# EAGLE design solarSwitcherV2.0 (EAGLE 7.2.0)
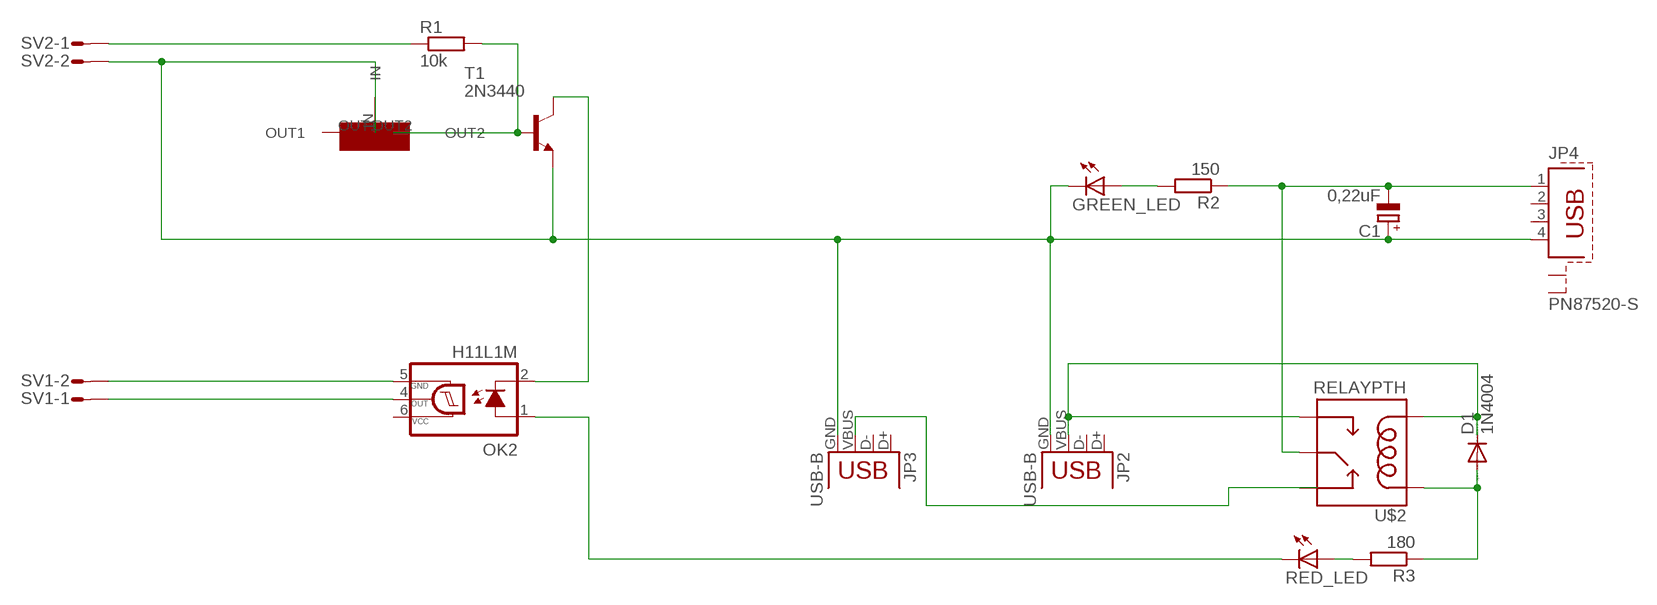
[diagram p0: schematic, sheet 1]

## Parts
C1  0,22uF  CPOL-EU150CLZ-1014  [150CLZ-1014]
D1  1N4004  [DO41-10]
GREEN_LED  LED5MM  [LED5MM]
JP2  USB-B  USBPTH  [USB-B-PTH]
JP3  USB-B  USBPTH  [USB-B-PTH]
JP4  PN87520-S  [PN87520-S]
OK2  H11L1M  [DIL06]
R1  10k  R-EU_0207/10  [0207/10]
R2  150  R-EU_0207/10  [0207/10]
R3  180  R-EU_0207/10  [0207/10]
RED_LED  LED5MM  [LED5MM]
SV1  L02P  [L02P]
SV2  L02P  [L02P]
T1  2N3440  [TO5]
U$2  RELAYPTH  [SRD-05VDC-SL-C]
U$5  20k  POT_TRIMMER  [POT_TRIMMER]

## Nets
N$1: R1.2 T1.2(B) U$5.OUT2
N$2: C1.- JP4.1 R2.1 U$2.SWCOMMON
N$3: OK2.1(A) RED_LED.K(C)
N$4: OK2.4(OUT) SV1.1
N$5: R1.1 SV2.1
N$6: JP3.VBUS U$2.SWCLOSED(SWCLOSE)
N$7: OK2.5(GND) SV1.2
N$8: C1.+ GREEN_LED.K(C) JP2.GND JP3.GND JP4.4 SV2.2 T1.1(E) U$5.IN
N$9: OK2.2(C) T1.3(C)
N$10: D1.A R3.1 U$2.COIL1
N$12: D1.C JP2.VBUS U$2.COIL0 U$2.SWOPEN
N$13: GREEN_LED.A R2.2
N$14: R3.2 RED_LED.A
Unconnected: JP2.D+ JP2.D- JP3.D+ JP3.D- JP4.2 JP4.3 JP4.S1 JP4.S2 U$5.OUT1

## Power pins joined to a net without a drawn wire
VCC: OK2.6(VCC)

## Library data of the parts
C1 = rcl:CPOL-EU: POLARIZED CAPACITOR, European symbol
D1 = diode:1N4004: DIODE general purpose rectifier, 1 A
GREEN_LED RED_LED = led:LED: LED OSRAM: - CHIPLED LG R971, LG N971, LY N971, LG Q971, LY Q971, LO R971, LY R971 LH N974, LH R974 LS Q976, LO Q976, LY Q976 LO Q996 - Hyper CHIPLED LW Q18S LB Q993, LB Q99A, LB R99A - SideLED LS A670, LO A670, LY A670, LG A670, LP A670 LB A673, LV A673, LT A673, LW A673 LH A674 LY A675 LS A676, LA A676, LO A676, LY A676, LW A676 LS A679, LY A679, LG A679 - Hyper Micro SIDELED® LS Y876, LA Y876, LO Y876, LY Y876 LT Y87S - SmartLED LW L88C, LW L88S LB L89C, LB L89S, LG L890 LS L89K, LO L89K, LY L89K LS L896, LA L896, LO L896, LY L896 - TOPLED LS T670, LO T670, LY T670, LG T670, LP T670 LSG T670, LSP T670, LSY T670, LOP T670, LYG T670 LG T671, LOG T671, LSG T671 LB T673, LV T673, LT T673, LW T673 LH T674 LS T676, LA T676, LO T676, LY T676, LB T676, LH T676, LSB T676, LW T676 LB T67C, LV T67C, LT T67C, LS T67K, LO T67K, LY T67K, LW E67C LS E67B, LA E67B, LO E67B, LY E67B, LB E67C, LV E67C, LT E67C LW T67C LS T679, LY T679, LG T679 LS T770, LO T770, LY T770, LG T770, LP T770 LB T773, LV T773, LT T773, LW T773 LH T774 LS E675, LA E675, LY E675, LS T675 LS T776, LA T776, LO T776, LY T776, LB T776 LHGB T686 LT T68C, LB T68C - Hyper Mini TOPLED® LB M676 - Mini TOPLED Santana® LG M470 LS M47K, LO M47K, LY M47K Source: http://www.osram.convergy.de LUXEON: - LUMILED® LXK2-PW12-R00, LXK2-PW12-S00, LXK2-PW14-U00, LXK2-PW14-V00 LXK2-PM12-R00, LXK2-PM12-S00, LXK2-PM14-U00 LXK2-PE12-Q00, LXK2-PE12-R00, LXK2-PE12-S00, LXK2-PE14-T00, LXK2-PE14-U00 LXK2-PB12-K00, LXK2-PB12-L00, LXK2-PB12-M00, LXK2-PB14-N00, LXK2-PB14-P00, LXK2-PB14-Q00 LXK2-PR12-L00, LXK2-PR12-M00, LXK2-PR14-Q00, LXK2-PR14-R00 LXK2-PD12-Q00, LXK2-PD12-R00, LXK2-PD12-S00 LXK2-PH12-R00, LXK2-PH12-S00 LXK2-PL12-P00, LXK2-PL12-Q00, LXK2-PL12-R00 Source: www.luxeon.com KINGBRIGHT: KA-3528ASYC Source: www.kingbright.com
JP2 JP3 = SparkFun-Connectors:USB: USB Connectors USB-B-PTH is fully proven SKU : PRT-00139/CONN-08278 USB-miniB is fully proven SKU : PRT-00587 USB-A-PCB is untested. USB-A-H is throughly reviewed, but untested. Spark Fun Electronics SKU : PRT-00437 USB-B-SMT is throughly reviewed, but untested. Needs silkscreen touching up. USB-A-S has not been used/tested USB-MB-H has not been used/tested USB-MICROB has been used. CONN-09505; PROD_ID: CONN-08278
JP4 = con-berg:PN87520-S; OC_FARNELL: unknown; OC_NEWARK: unknown
OK2 = optocoupler:H11L*M: 6-Pin DIP Optocoupler Source: http://www.fairchildsemi.com/ds/H1/H11L2-M.pdf; MF: FAIRCHILD SEMICONDUCTOR; MPN: H11L1-M; OC_FARNELL: 1021127; OC_NEWARK: 72K8643
R1-R3 = resistor:R-EU_: RESISTOR, European symbol
SV1 SV2 = con-amp-mt:L02P: AMP MT CONNECTOR; OC_FARNELL: unknown; OC_NEWARK: unknown
T1 = transistor:2N3440: NPN TRANSISTOR
U$2 = SRD-05VDC-SL-C:RELAY: SPDT relay (COM-00101)
U$5 = MBLIB:POT_TRIMMER

## Board
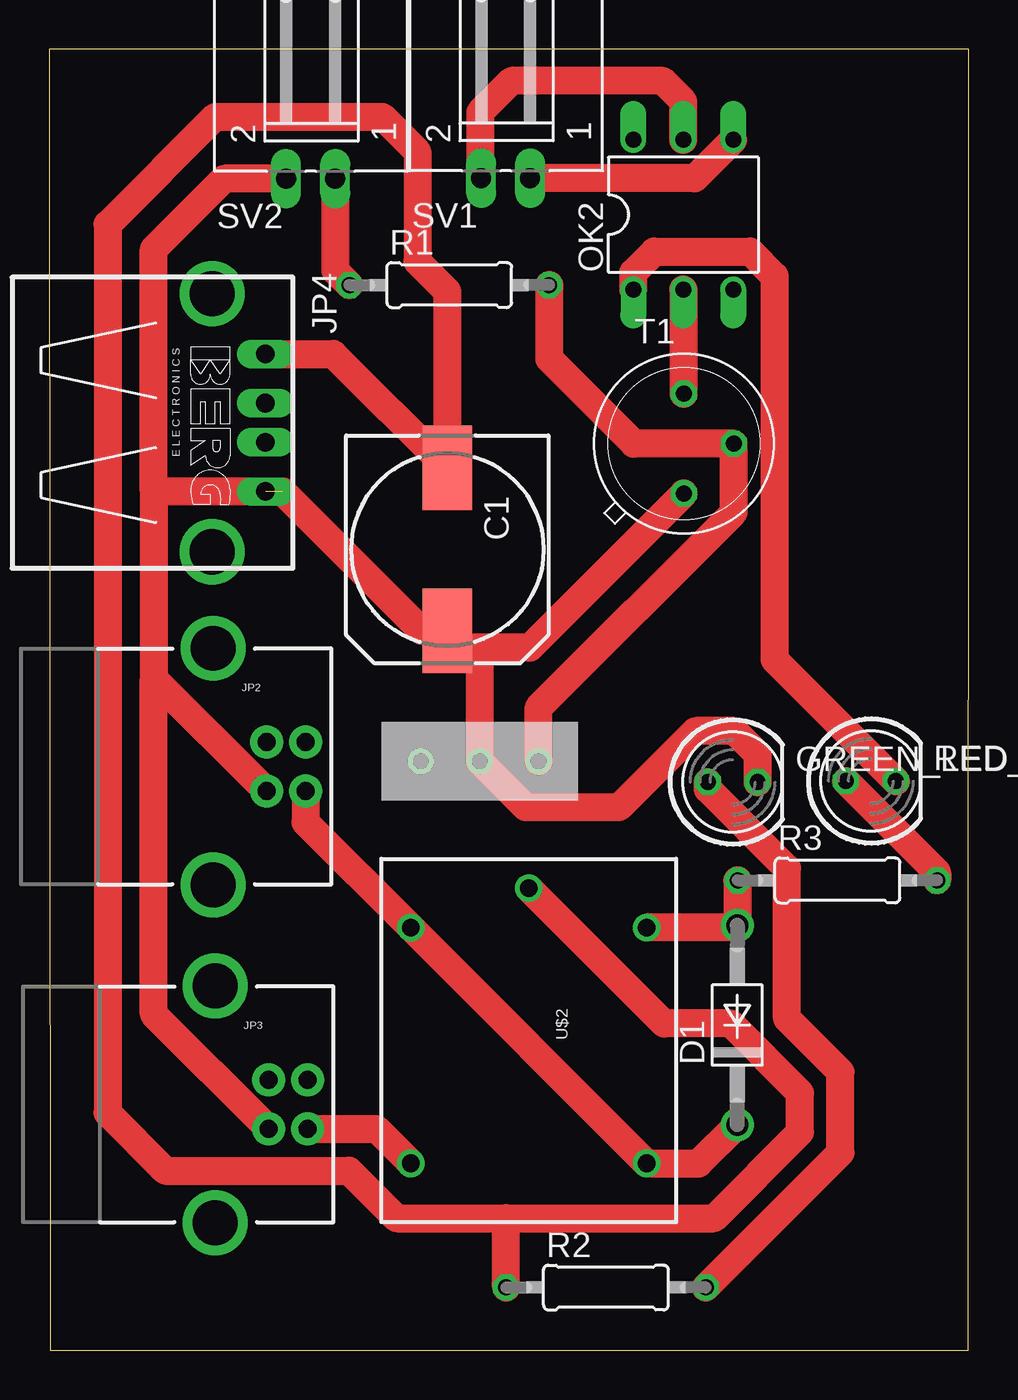
[diagram p1: board, top side]
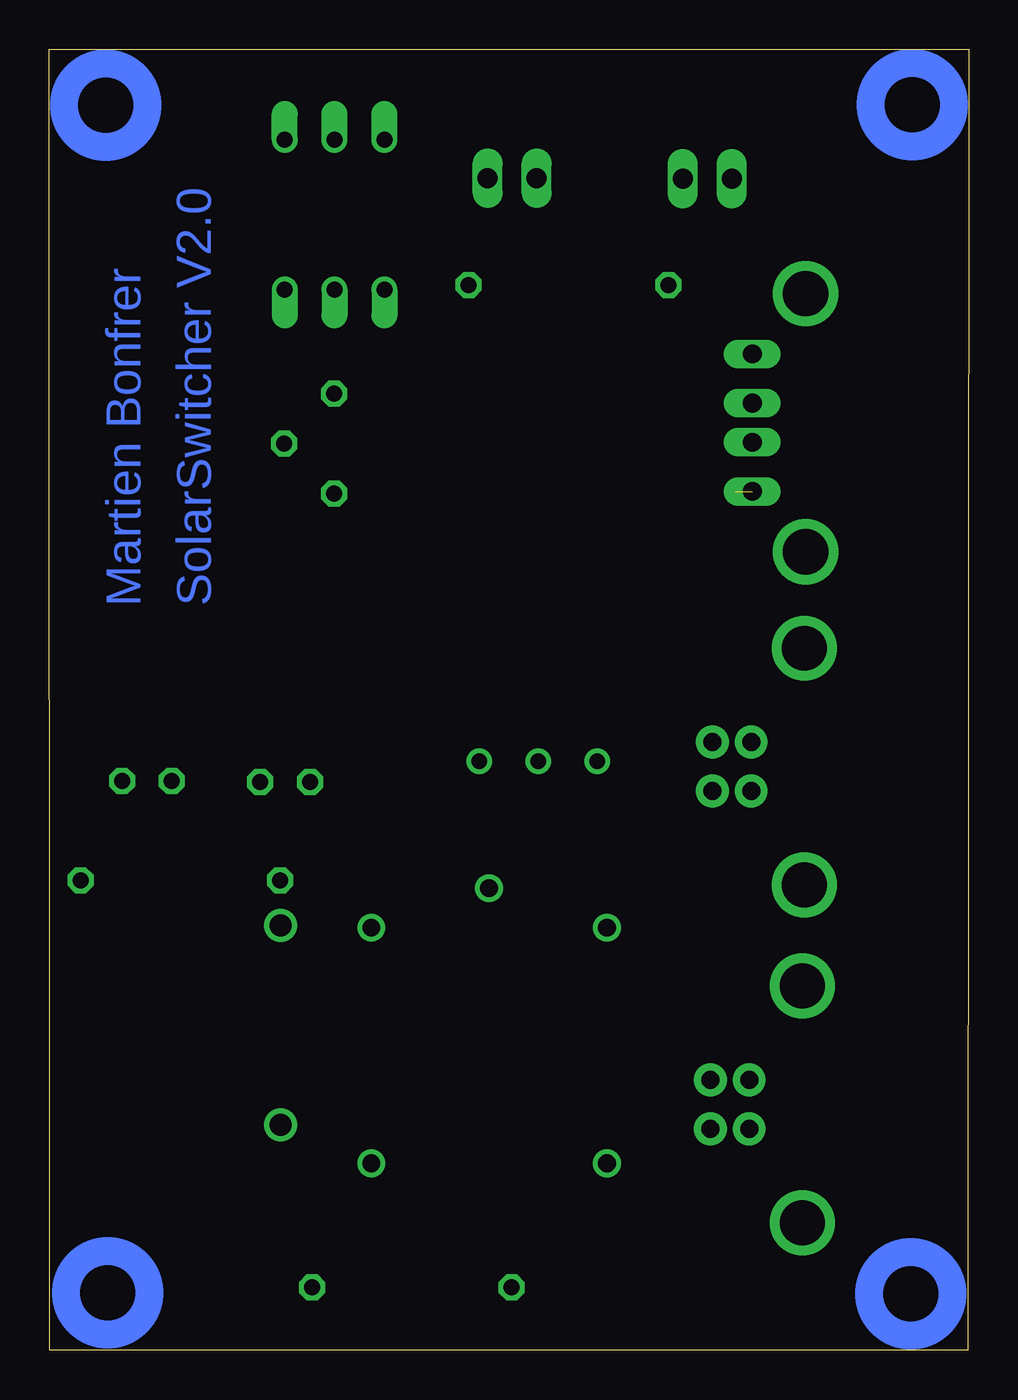
[diagram p2: board, bottom side, seen from below]

Size 46.81 x 66.23 mm. Coordinates in mm from the lower left corner, seen from the top.
Outline: 0.05,0 46.79,0 46.81,66.23 0,66.23 0.05,0
Copper layers (1*16): Top 0.035mm / dielectric 1.5mm / Bottom 0.035mm
Design rules "default": minimum track width 10mil, minimum drill 24mil, track to track 8mil, track to pad 8mil, pad to pad 8mil, via to via 8mil, smd to smd 8mil, copper to edge 40mil, drill to drill 8mil, minimum pad ring 10mil, minimum via ring 8mil, stop-mask expansion 4mil, vias tented up to drill 0mil, thermal gap 10mil

### Footprints (pad centres in the part's own frame; a part is rotated, then mirrored left to right if it is on the bottom)
150CLZ-1014 = smd 4.3 x 2.5: + 4.15,0; - -4.15,0
DO41-10 = drill 1.118: A 5.08,0; C -5.08,0
LED5MM = drill 0.813 octagon: A -1.27,0; K 1.27,0
USB-B-PTH = drill 0.914 pad 1.676: D+ 0,1.25; D- 1.981,1.25; GND 0,-1.25; VBUS 1.981,-1.25 | drill 2.286: S1 -2.718,-6.02; S2 -2.718,6.02
PN87520-S = drill 0.95 long: 1 -3.5,2.71; 2 -1,2.71; 3 1,2.71; 4 3.5,2.71 | drill 2.3 pad 2.9: S1 -6.57,0; S2 6.57,0
DIL06 = drill 0.813 offset: 1 -2.54,-3.81; 2 0,-3.81; 3 2.54,-3.81; 4 2.54,3.81; 5 0,3.81; 6 -2.54,3.81
0207/10 = drill 0.813 octagon: 1 -5.08,0; 2 5.08,0
L02P = drill 1.016 long: 1 1.25,-6.25; 2 -1.25,-6.25
TO5 = drill 0.813 octagon: 1 0,-2.54; 2 2.54,0; 3 0,2.54
SRD-05VDC-SL-C = drill 0.9: COIL0 -5.39,-6.12; COIL1 -5.39,5.88; SWCLOSED 6.61,-6.12; SWCOMMON -7.39,-0.12; SWOPEN 6.61,5.88
POT_TRIMMER = drill 0.8: IN 5,2; OUT1 2,2; OUT2 8,2

### Placement (x,y rotation side)
C1  20.27,40.77 270 top
D1  35.03,16.56 90 top
GREEN_LED  34.8,28.93 0 top
JP2  11.07,29.72 0 top
JP3  11.18,12.52 0 top
JP4  8.31,47.22 270 top
OK2  32.28,57.81 0 top
R1  20.37,54.23 0 top
R2  28.35,3.2 0 top
R3  40.13,23.93 0 top
RED_LED  41.83,28.98 0 top
SV1  23.24,65.91 0 top
SV2  13.31,65.89 0 top
T1  32.31,46.15 0 top
U$2  24.54,16.13 270 top
U$5  16.92,27.99 0 top

### Tracks (layer width: path | path; a pad name or v marks a point on that pad's centre or on a via)
N$1
  Top 1.422: R1.2 25.45,50.47 29.77,46.15 T1.2 34.85,42.65 24.92,32.71 U$5.OUT2
N$2
  Top 1.422: JP4.1 14.47,50.72 C1.- 20.27,53.9 18.75,55.42 18.75,61.01 16.97,62.79 8.46,62.79 2.97,57.3 2.97,12.09 5.92,9.14 15.27,9.14 17.68,6.73 23.27,6.73 | 23.27,6.73 33.86,6.73 38.23,11.1 38.23,13.11 34.7,16.64 31.3,16.64 U$2.SWCOMMON | R2.1 23.27,6.73
N$3
  Top 1.422: OK2.1 29.74,54.86 30.81,55.93 35.69,55.93 36.93,54.69 36.93,35.15 RED_LED.K
N$4
  Top 1.422: OK2.4 32.87,59.66 SV1.1
N$5
  Top 1.422: SV2.1 14.56,54.96 R1.1
N$6
  Top 1.422: JP3.VBUS 16.66,11.27 U$2.SWCLOSED
N$7
  Top 1.422: OK2.5 32.28,63.58 31.24,64.62 23.55,64.62 21.95,63.02 21.95,59.71 SV1.2
N$8  (1 unrouted)
  Top 1.422: 21.12,35.77 C1.+ 18.98,36.62 11.89,43.71 5.33,43.71 | 21.12,35.77 21.92,34.97 U$5.IN 24.27,27.64 29.01,27.64 32.89,31.52 34.87,31.52 36.07,30.33 GREEN_LED.K | T1.1 24.47,35.77 21.12,35.77 | SV2.2 8.91,59.64 5.33,56.06 5.33,43.71 | 5.33,43.71 5.33,36.63 5.33,34.21 | 5.33,34.21 JP2.GND | JP3.GND 5.33,17.11 5.33,34.21
N$9
  Top 1.422: T1.3 32.31,53.97 OK2.2
N$10
  Top 1.422: U$2.COIL1 34.91,21.52 D1.A 35.03,23.9 R3.1
N$12
  Top 1.422: JP2.VBUS 13.06,26.88 U$2.COIL0 U$2.SWOPEN 33.07,9.52 D1.C
N$13
  Top 1.422: R2.2 40.28,10.06 40.28,14.17 37.57,16.89 37.57,24.54 33.53,28.57 GREEN_LED.A
N$14
  Top 1.422: RED_LED.A 45.21,24.33 R3.2
(copper drawn outside any net)
  shapes: Bottom circle x4

### Text on the board
Bottom: SolarSwitcher V2.0 | Martien Bonfrer